# EAGLE design eeZeeAmpJig (EAGLE 7.1.0)
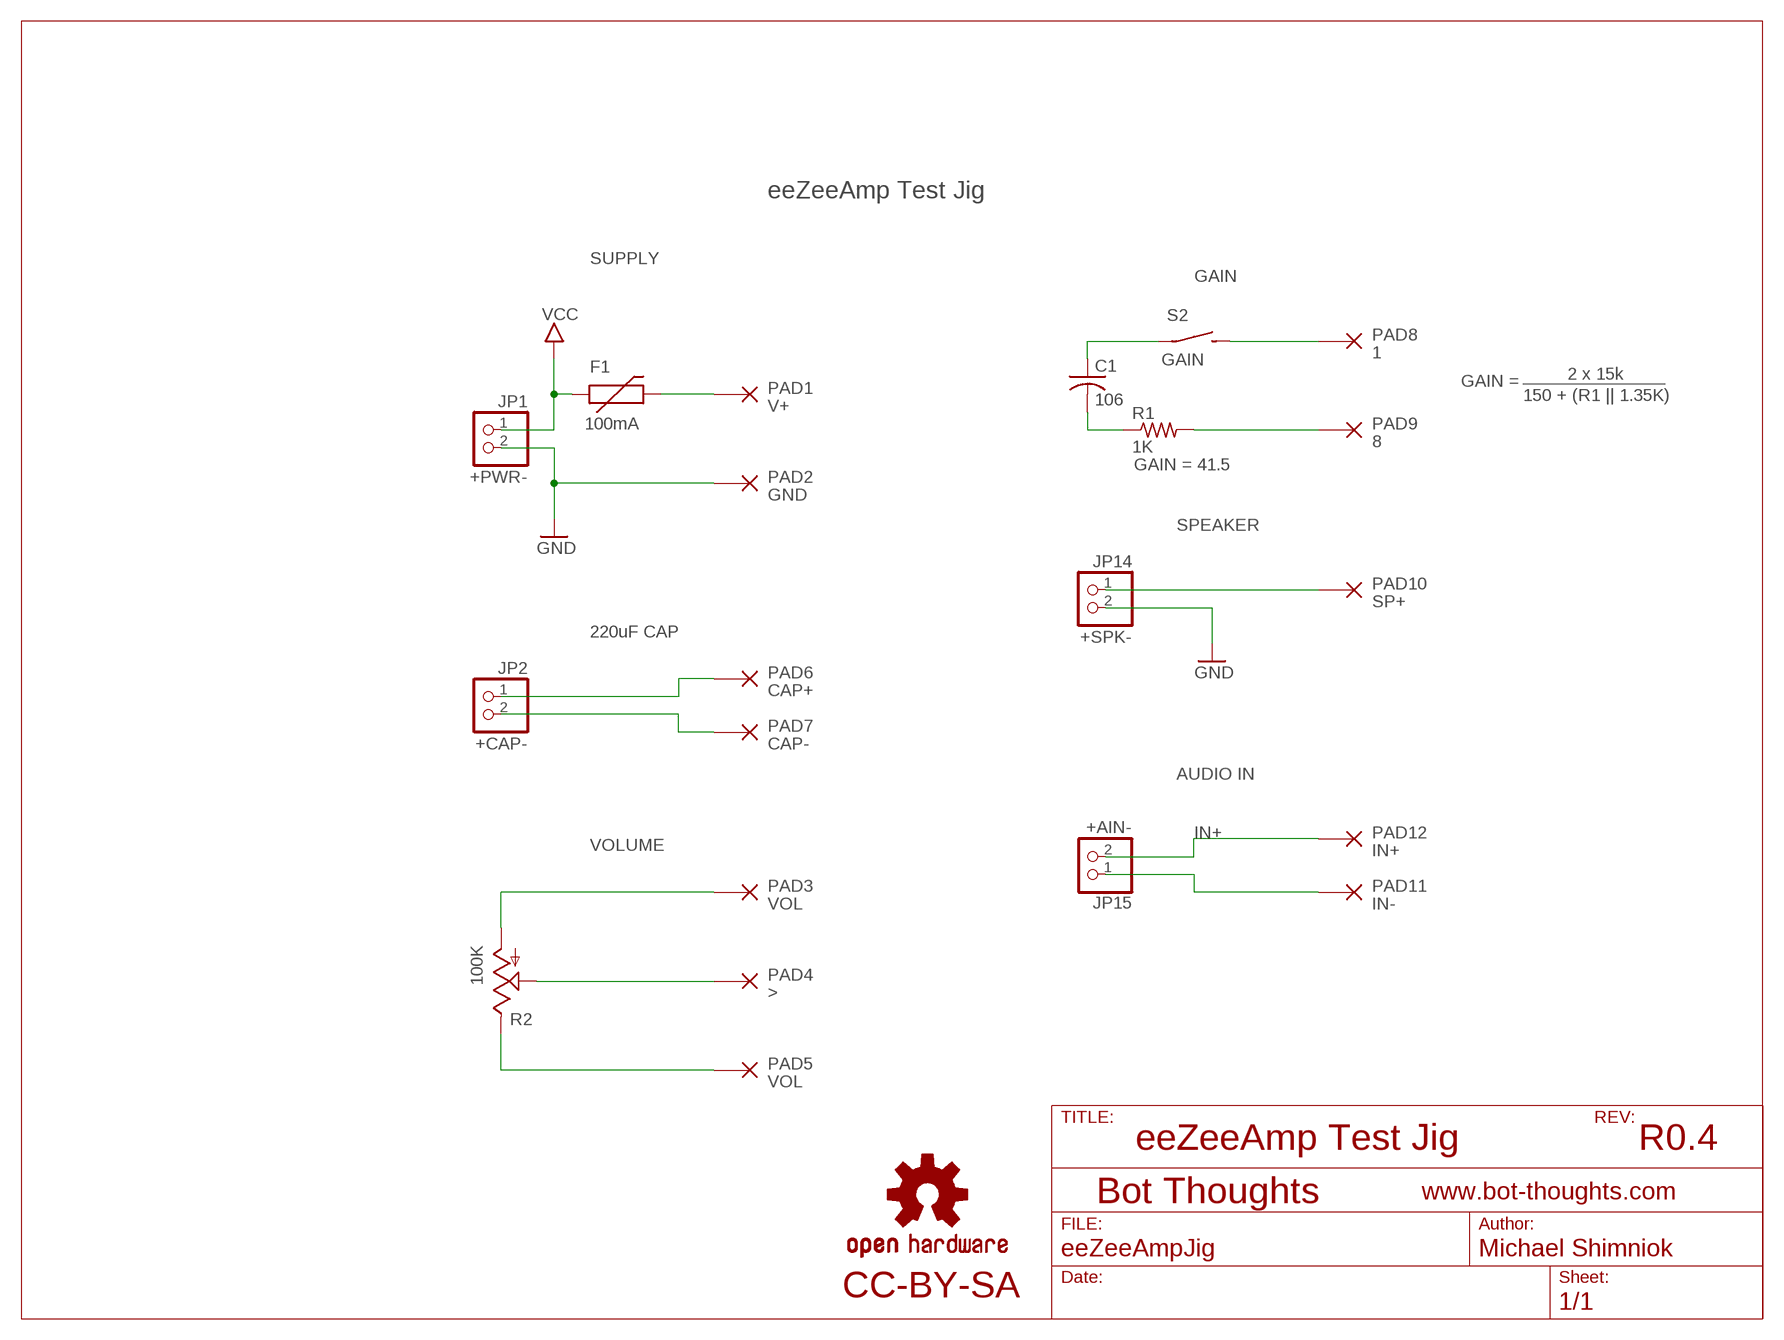
[diagram p0: schematic, sheet 1]

## Parts
C1  106  C-USC0805  [C0805]
F1  100mA  PTC0603  [0603]
JP1  +PWR-  PINHD-1X02_2.54-S  [1X02-S]
JP2  +CAP-  PINHD-1X02_2.54-S  [1X02-S]
JP14  +SPK-  PINHD-1X02_2.54-S  [1X02-S]
JP15  +AIN-  PINHD-1X02_2.54-S  [1X02-S]
LOGO2  OSHW-LOGOS  [OSHW-LOGO-S]
PAD1  V+  WIREPAD_1.2MM  [POGO_1.02MM]
PAD2  GND  WIREPAD_1.2MM  [POGO_1.02MM]
PAD3  VOL  WIREPAD_1.2MM  [POGO_1.02MM]
PAD4  >  WIREPAD_1.2MM  [POGO_1.02MM]
PAD5  VOL  WIREPAD_1.2MM  [POGO_1.02MM]
PAD6  CAP+  WIREPAD_1.2MM  [POGO_1.02MM]
PAD7  CAP-  WIREPAD_1.2MM  [POGO_1.02MM]
PAD8  1  WIREPAD_1.2MM  [POGO_1.02MM]
PAD9  8  WIREPAD_1.2MM  [POGO_1.02MM]
PAD10  SP+  WIREPAD_1.2MM  [POGO_1.02MM]
PAD11  IN-  WIREPAD_1.2MM  [POGO_1.02MM]
PAD12  IN+  WIREPAD_1.2MM  [POGO_1.02MM]
R1  1K  R-US_R0603  [R0603]
R2  100K  TRIM_US-CA6H  [CA6H]
S2  GAIN  SPST_3X4X2  [3X4X2TACT]

## Nets
1: C1.1 S2.P$1(P)
3: PAD4.P$1(P) R2.S
8: PAD9.P$1(P) R1.2
GND: JP1.2 JP14.2 PAD2.P$1(P)
IN+: JP15.2 PAD12.P$1(P)
IN-: JP15.1 PAD11.P$1(P)
N$1: PAD8.P$1(P) S2.P$2(S)
N$2: JP2.1 PAD6.P$1(P)
N$3: PAD5.P$1(P) R2.E
N$4: F1.2 PAD1.P$1(P)
N$5: C1.2 R1.1
N$6: JP2.2 PAD7.P$1(P)
N$8: PAD3.P$1(P) R2.A
SPEAKER: JP14.1 PAD10.P$1(P)
VCC: F1.1 JP1.1

## Notes on the sheet
- eeZeeAmp Test Jig
- SUPPLY
- GAIN
- 2 x 15k
- GAIN =
- 150 + (R1 || 1.35K)
- GAIN = 41.5
- SPEAKER
- 220uF CAP
- AUDIO IN
- VOLUME
- eeZeeAmp Test Jig | R0.4
- CC-BY-SA

## Library data of the parts
C1 = rcl:C-US: CAPACITOR, American symbol
F1 = bt:PTC: Resettable Fuse PTC Resettable Fuse. Spark Fun Electronics SKU : COM-08357
JP1 JP2 JP14 JP15 = pinhead-2:PINHD-1X02: PIN HEADER
LOGO2 = SparkFun-Aesthetics:OSHW-LOGO: Open Source Hardware Logo This logo indicates the piece of hardware it is found on incorporates a OSHW license and/or adheres to the definition of open source hardware found here: http://freedomdefined.org/OSHW
PAD1-PAD12 = bt_electromech:WIREPAD: PIN PAD (PINPAD) Generic pin pad connector
R1 = rcl:R-US_: RESISTOR, American symbol
R2 = pot:TRIM_US-: POTENTIOMETER
S2 = bt_electromech:SPST: SPST SWITCH

## Board
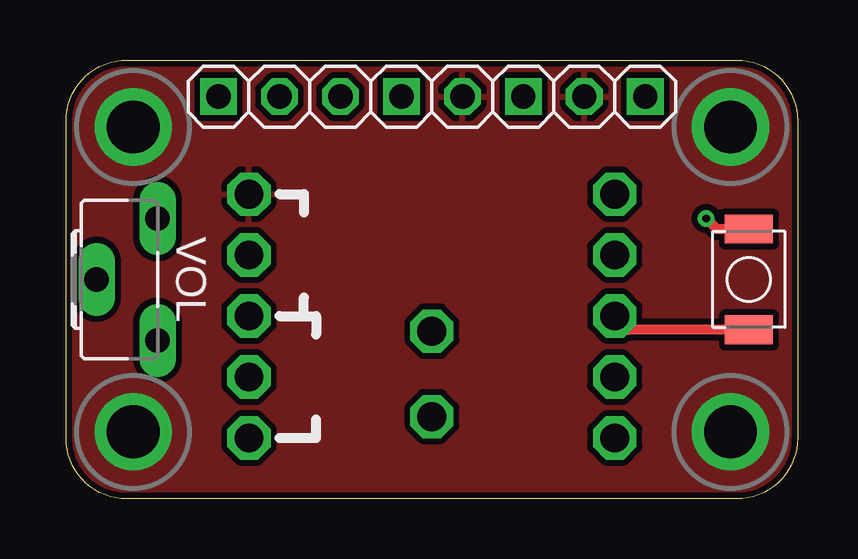
[diagram p1: board, top side]
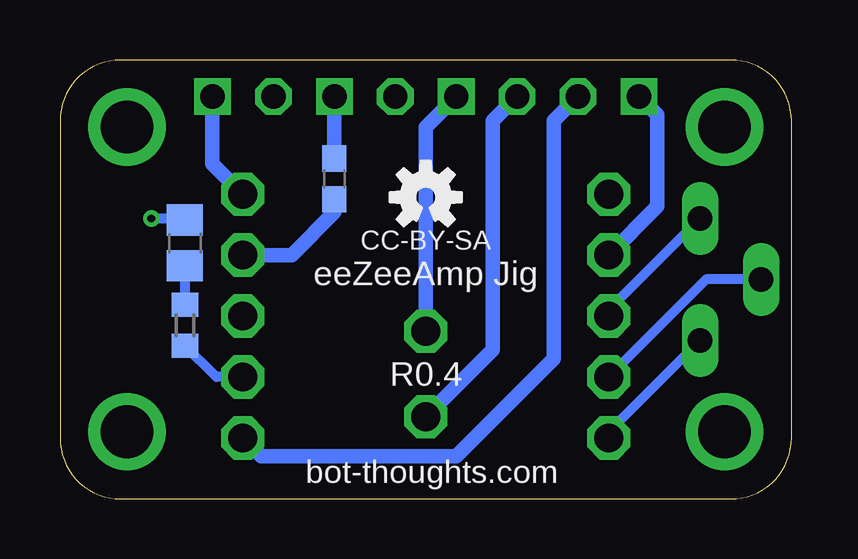
[diagram p2: board, bottom side, seen from below]

Size 30.48 x 18.29 mm. Coordinates in mm from the lower left corner, seen from the top.
Outline: 0,2.54 0,15.75 arc-90 2.54,18.29 27.94,18.29 arc-90 30.48,15.75 30.48,2.54 arc-90 27.94,0 2.54,0 arc-90 0,2.54
Copper layers (1*16): Top 0.0356mm / dielectric 1.5011mm / Bottom 0.0356mm
Design rules "LaenPCBOrder *": minimum track width 6mil, minimum drill 13mil, track to track 10mil, track to pad 10mil, pad to pad 10mil, via to via 10mil, smd to smd 8mil, copper to edge 10mil, drill to drill 10mil, minimum pad ring 7mil, minimum via ring 7mil, stop-mask expansion 3mil, vias tented up to drill 20mil, thermal gap 10mil

### Footprints (pad centres in the part's own frame; a part is rotated, then mirrored left to right if it is on the bottom)
C0805 = smd 1.3 x 1.5: 1 -0.95,0; 2 0.95,0
0603 = smd 1.1 x 1: 1 -0.85,0; 2 0.85,0
1X02-S = drill 1.016 square: 1 -1.27,0 | drill 1.016 octagon: 2 1.27,0
POGO_1.02MM = drill 1.2 octagon: P$1 0,0
R0603 = smd 1 x 1.1: 1 -0.85,0; 2 0.85,0
CA6H = drill 1.016 long: A -2.54,0; E 2.54,0; S 0,2.54
3X4X2TACT = smd 1.2 x 2: P$1 -2.1,0; P$2 2.1,0

### Placement (x,y rotation side)
C1  25.27,10.67 270 bottom
F1  19.05,13.34 270 bottom
JP1  17.78,16.76 180 top
JP2  12.7,16.76 180 top
JP14  22.86,16.76 180 top
JP15  7.62,16.76 0 top
LOGO2  15.24,12.57 0 bottom
PAD1  22.86,10.16 180 top
PAD2  7.62,12.7 0 top
PAD3  7.62,2.54 0 top
PAD4  7.62,5.08 0 top
PAD5  7.62,7.62 0 top
PAD6  15.24,6.99 180 top
PAD7  15.24,3.43 0 top
PAD8  22.86,7.62 180 top
PAD9  22.86,5.08 180 top
PAD10  22.86,12.7 180 top
PAD11  7.62,10.16 0 top
PAD12  22.86,2.54 180 top
R1  25.27,7.24 270 bottom
R2  3.81,9.14 90 top
S2  28.45,9.14 270 top

### Tracks (layer width: path | path; a pad name or v marks a point on that pad's centre or on a via)
1  (via drill 0.33)
  Top 0.406: S2.P$1 27.11,11.24 v26.67,11.68
  Bottom 0.406: v26.67,11.68 25.34,11.68 C1.1
3
  Bottom 0.406: R2.S 3.56,9.14 PAD4.P$1
8
  Bottom 0.406: PAD9.P$1 23.96,5.08 R1.2
GND  (via drill 2.2)
  other vias: 2.79,15.49 27.69,15.49 27.69,2.79 2.79,2.79
  pour Top: 0,2.54 0,15.75 arc-90 2.54,18.29 27.94,18.29 arc-90 30.48,15.75 30.48,2.54 arc-90 27.94,0 2.54,0 arc-90
IN+
  Bottom 0.61: JP15.2 9.91,15.75 9.91,5.84 13.97,1.78 22.1,1.78 PAD12.P$1
IN-
  Bottom 0.61: JP15.1 5.59,16 5.59,12.19 PAD11.P$1
N$1
  Top 0.406: S2.P$2 23.44,7.04 PAD8.P$1
N$2
  Bottom 0.61: JP2.1 15.24,15.49 PAD6.P$1
N$3
  Bottom 0.406: PAD5.P$1 7.62,7.87 R2.E
N$4
  Bottom 0.61: F1.2 19.05,11.94 20.83,10.16 PAD1.P$1
N$5
  Bottom 0.406: C1.2 R1.1
N$6
  Bottom 0.61: JP2.2 12.45,15.75 12.45,6.22 PAD7.P$1
N$8
  Bottom 0.406: PAD3.P$1 7.62,2.79 R2.A
SPEAKER
  Bottom 0.61: JP14.1 24.13,13.97 PAD10.P$1
VCC
  Bottom 0.61: JP1.1 F1.1

### Text on the board
tNames: VOL
bNames: CC-BY-SA | eeZeeAmp Jig | R0.4 | bot-thoughts.com
tsilk: +AIN- | +PWR- | +SPK- | SP+ | GND | V+ | VOL | GAIN | 1 | VOL | 8 | > | IN+
bsilk: 100mA | 100K | CC-BY-SA | 106 | eeZeeAmp Jig | 1K | R0.3 | bot-thoughts.com